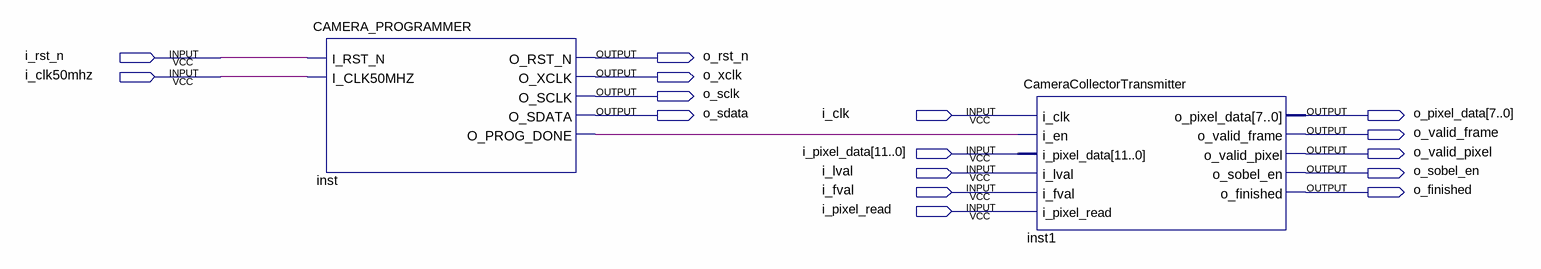
[diagram p0: schematic sheet]
// Quartus schematic CameraInterface.bdf as structural Verilog: 2 symbols, 16 pins
module CameraInterface (
  input  i_rst_n,
  input  i_clk50mhz,
  input  i_clk,
  input  [11:0] i_pixel_data,
  input  i_lval,
  input  i_fval,
  input  i_pixel_read,
  output o_rst_n,
  output o_xclk,
  output o_sclk,
  output o_sdata,
  output [7:0] o_pixel_data,
  output o_valid_frame,
  output o_valid_pixel,
  output o_sobel_en,
  output o_finished
);

  wire inst_o_prog_done;

  CAMERA_PROGRAMMER inst (
    .I_RST_N(i_rst_n), .I_CLK50MHZ(i_clk50mhz), .O_RST_N(o_rst_n), .O_XCLK(o_xclk), .O_SCLK(o_sclk),
    .O_SDATA(o_sdata), .O_PROG_DONE(inst_o_prog_done));
  CameraCollectorTransmitter inst1 (
    .i_clk(i_clk), .i_en(inst_o_prog_done), .i_pixel_data(i_pixel_data), .i_lval(i_lval), .i_fval(i_fval),
    .i_pixel_read(i_pixel_read), .o_pixel_data(o_pixel_data), .o_valid_frame(o_valid_frame),
    .o_valid_pixel(o_valid_pixel), .o_sobel_en(o_sobel_en), .o_finished(o_finished));
endmodule
